# EasyEDA schematic SCH_moisture sensor-rev_2021-10-16.json
TITLE: Sheet_1; REV: 1.0; Date: 2021-10-16; Sheet: 1/1; Drawn By: Chris Wallace; Company: Your Company
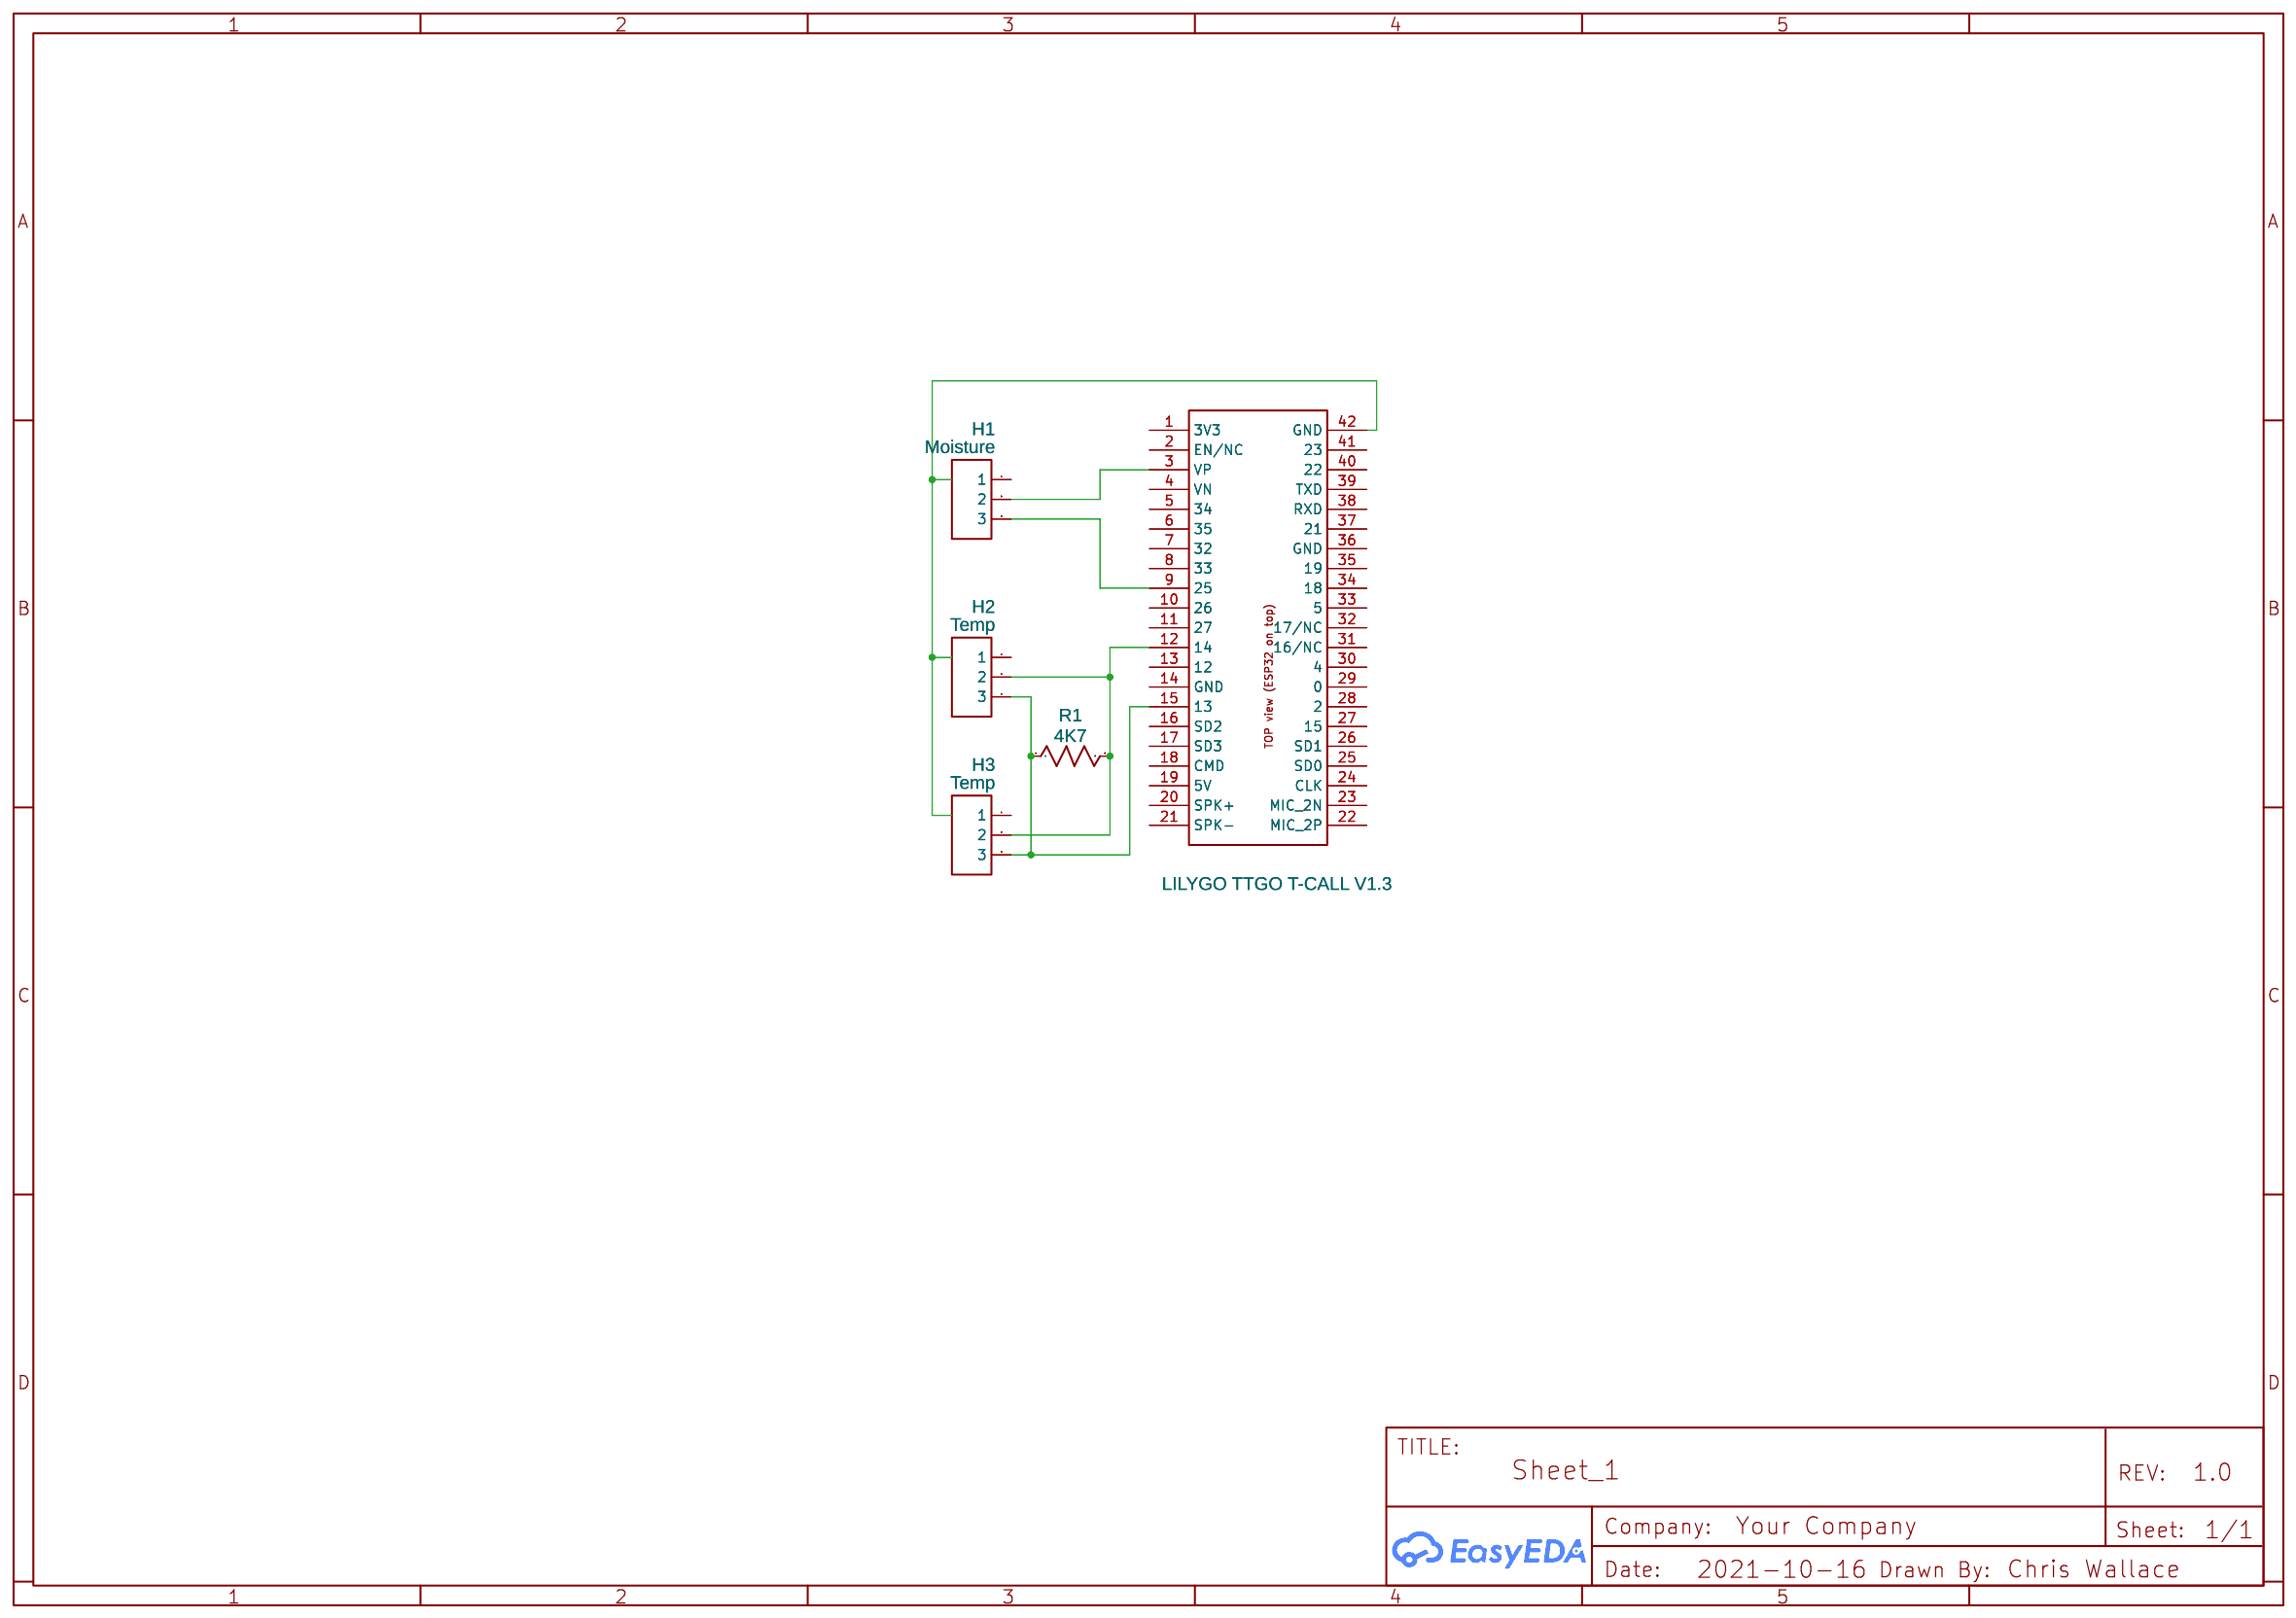
[diagram p0: schematic sheet]

## Parts
H1  Moisture  [HDR-F-2.54_1X3]
H2  Temp  [HDR-F-2.54_1X3]
H3  Temp  [HDR-F-2.54_1X3]
R1  4K7  [R0603]
U1  LILYGO TTGO T-CALL V1.3  [LILYGO TTGO T-SIM7000G]

## Library data of the parts
H1-H3 = HDR-F-2.54_1x3: Supplier Part: C146690; Supplier: LCSC; Contributor: LCEDA_Lib
R1 = R_0603_US: Contributor: LCEDA_Lib
U1 = LILYGO TTGO T-CALL V1.3: Manufacturer: Lilygo; Supplier Part: T-Call v1.3 20190610; Contributor: umar_CIR

## Nets
Net-(H1-2): H1.2 U1.3(VP)
Net-(H1-3): H1.3 U1.9(25)
Net-(H2-2): H2.2 H3.2 R1.2 U1.12(14)
Net-(H2-3): H2.3 H3.3 R1.1 U1.15(13)

Not connected (* = marked no-connect by the designer): H1 1; H2 1; H3 1; U1 1(3V3) 2(EN/NC) 4(VN) 5(34) 6(35) 7(32) 8(33) 10(26) 11(27) 13(12) 14(GND) 16(SD2) 17(SD3) 18(CMD) 19(5V) 20(SPK+) 21(SPK-) 22(MIC_2P) 23(MIC_2N) 24(CLK) 25(SD0) 26(SD1) 27(15) 28(2) 29(0) 30(4) 31(16/NC) 32(17/NC) 33(5) 34(18) 35(19) 36(GND) 37(21) 38(RXD) 39(TXD) 40(22) 41(23) 42(GND)
